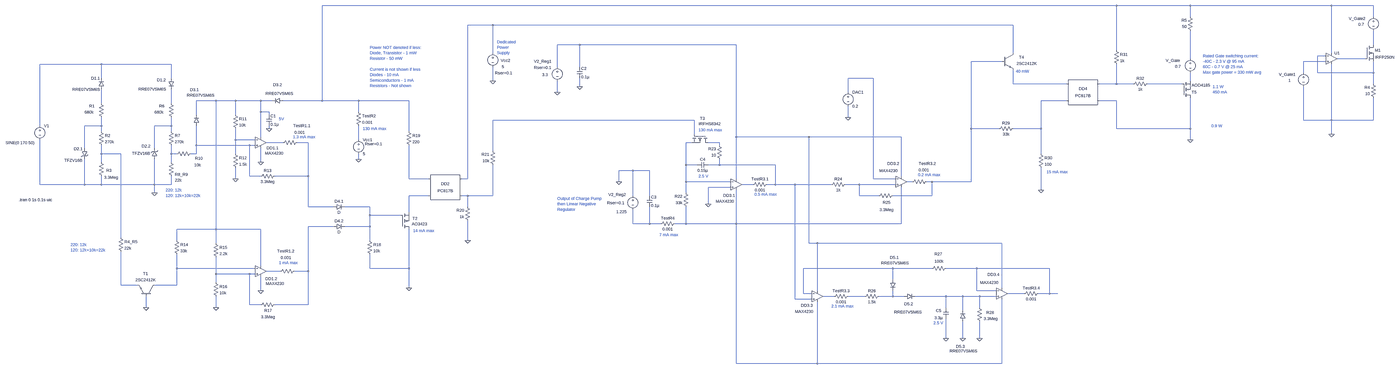
[diagram p0: schematic thyristor2.asc, whole sheet]
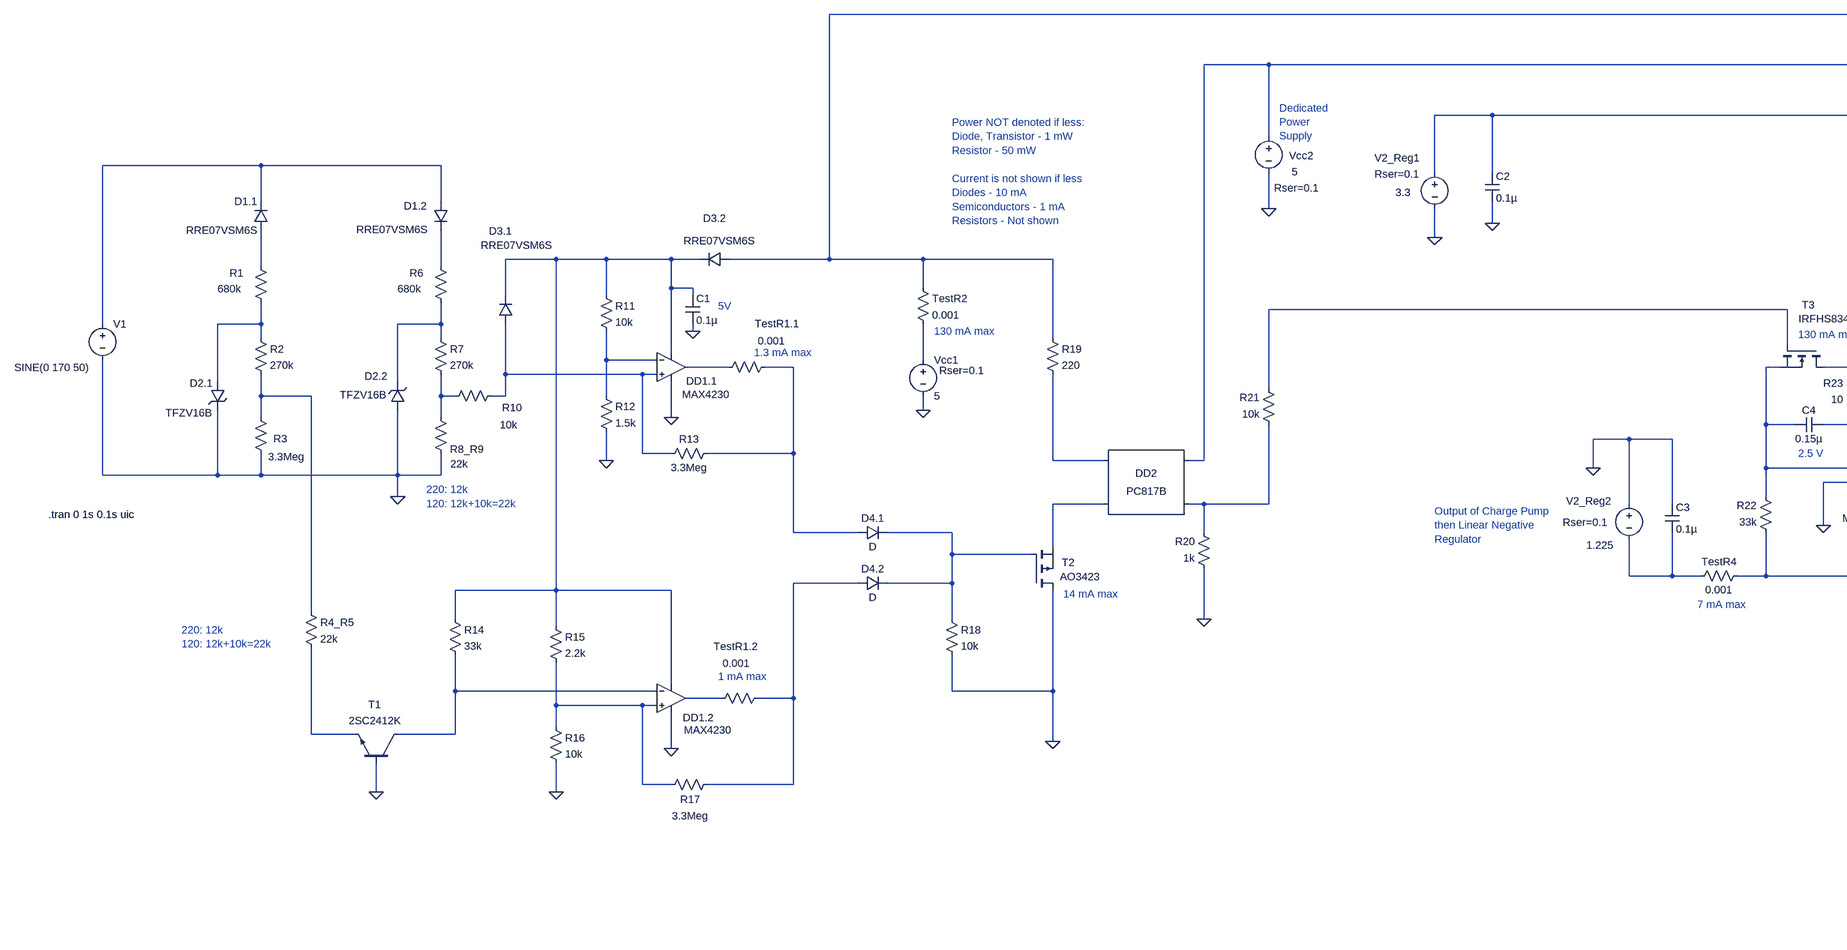
[diagram p1: schematic thyristor2.asc, part, row 1 of 1, column 1 of 2]
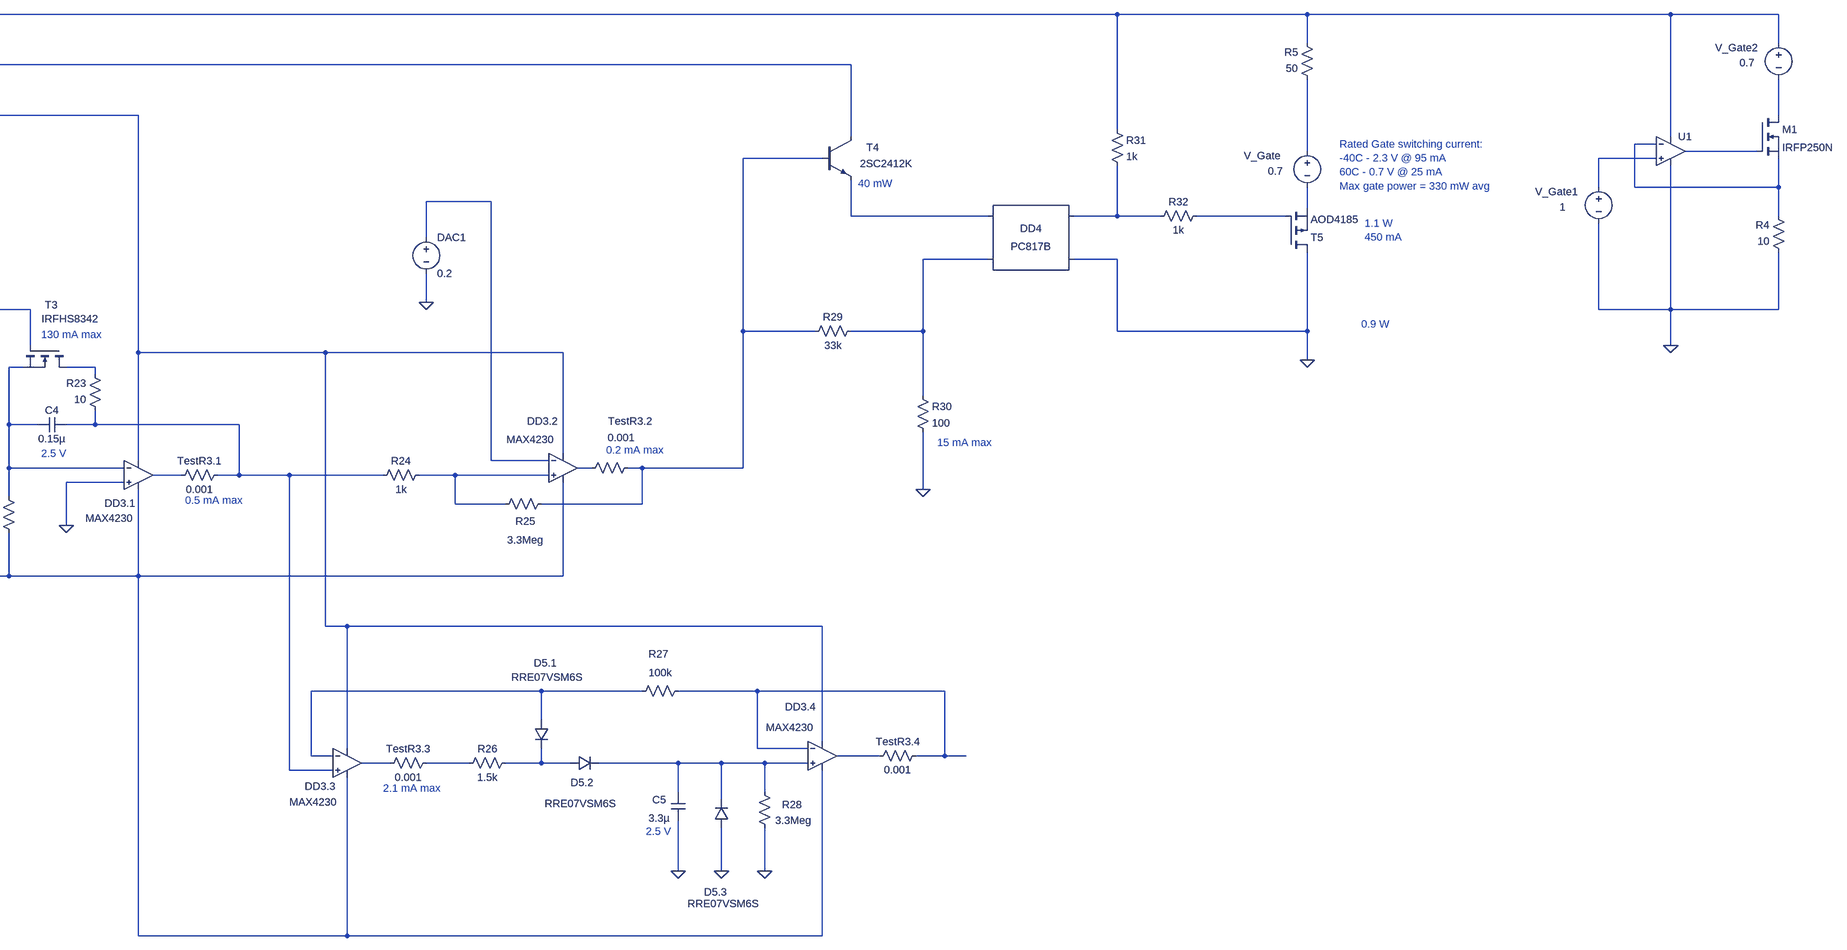
[diagram p2: schematic thyristor2.asc, part, row 1 of 1, column 2 of 2]
thyristor2.asc, the LTspice schematic file:
Version 4
SHEET 1 6072 1092
WIRE 4096 -1072 -464 -1072
WIRE 4608 -1072 4096 -1072
WIRE 5696 -1072 4608 -1072
WIRE 5936 -1072 5696 -1072
WIRE 4608 -1008 4608 -1072
WIRE 5936 -1008 5936 -1072
WIRE 512 -960 368 -960
WIRE 3504 -960 512 -960
WIRE 1024 -848 896 -848
WIRE 1920 -848 1024 -848
WIRE 5936 -848 5936 -928
WIRE 4096 -816 4096 -1072
WIRE 512 -800 512 -960
WIRE 3504 -800 3504 -960
WIRE 5696 -800 5696 -1072
WIRE 5664 -784 5616 -784
WIRE 4608 -768 4608 -928
WIRE 5888 -768 5728 -768
WIRE 3440 -752 3264 -752
WIRE 5664 -752 5536 -752
WIRE -1728 -736 -2080 -736
WIRE -1328 -736 -1728 -736
WIRE 896 -720 896 -848
WIRE 1024 -720 1024 -848
WIRE 5536 -688 5536 -752
WIRE 5616 -688 5616 -784
WIRE 5936 -688 5936 -752
WIRE 5936 -688 5616 -688
WIRE -1728 -656 -1728 -736
WIRE -1328 -656 -1328 -736
WIRE 2704 -656 2560 -656
WIRE 512 -640 512 -720
WIRE 4608 -640 4608 -688
WIRE 3504 -624 3504 -704
WIRE 3808 -624 3504 -624
WIRE 4096 -624 4096 -736
WIRE 4096 -624 4000 -624
WIRE 4192 -624 4096 -624
WIRE 4560 -624 4272 -624
WIRE 5936 -624 5936 -688
WIRE 1024 -608 1024 -656
WIRE 896 -576 896 -640
WIRE 2560 -576 2560 -656
WIRE -1072 -528 -1184 -528
WIRE -960 -528 -1072 -528
WIRE -816 -528 -960 -528
WIRE -752 -528 -816 -528
WIRE -464 -528 -464 -1072
WIRE -464 -528 -688 -528
WIRE -256 -528 -464 -528
WIRE 32 -528 -256 -528
WIRE 3808 -528 3664 -528
WIRE 4096 -528 4000 -528
WIRE -1728 -512 -1728 -592
WIRE -1328 -512 -1328 -592
WIRE -816 -464 -816 -528
WIRE -768 -464 -816 -464
WIRE -256 -464 -256 -528
WIRE -1184 -448 -1184 -528
WIRE -960 -448 -960 -528
WIRE -768 -448 -768 -464
WIRE 2560 -432 2560 -496
WIRE 1680 -416 512 -416
WIRE 5536 -416 5536 -608
WIRE 5696 -416 5696 -736
WIRE 5696 -416 5536 -416
WIRE 5936 -416 5936 -544
WIRE 5936 -416 5696 -416
WIRE -2080 -384 -2080 -736
WIRE -1728 -384 -1728 -432
WIRE -1728 -384 -1824 -384
WIRE -1328 -384 -1328 -432
WIRE -1328 -384 -1424 -384
WIRE -768 -368 -768 -384
WIRE 3264 -368 3264 -752
WIRE 3424 -368 3264 -368
WIRE 3664 -368 3664 -528
WIRE 3664 -368 3504 -368
WIRE 4096 -368 4096 -528
WIRE 4608 -368 4608 -544
WIRE 4608 -368 4096 -368
WIRE -1728 -352 -1728 -384
WIRE -1328 -352 -1328 -384
WIRE 32 -352 32 -528
WIRE 1680 -336 1680 -416
WIRE 5696 -336 5696 -416
WIRE -816 -320 -816 -464
WIRE 1920 -320 1920 -848
WIRE 2336 -320 1920 -320
WIRE 2864 -320 2336 -320
WIRE -960 -304 -960 -368
WIRE -848 -304 -960 -304
WIRE -256 -304 -256 -384
WIRE 4608 -304 4608 -368
WIRE -688 -288 -784 -288
WIRE -544 -288 -608 -288
WIRE 1664 -288 1632 -288
WIRE 1824 -288 1760 -288
WIRE -1184 -272 -1184 -384
WIRE -880 -272 -1184 -272
WIRE -848 -272 -880 -272
WIRE 1824 -272 1824 -288
WIRE -1824 -256 -1824 -384
WIRE -1424 -256 -1424 -384
WIRE 512 -240 512 -416
WIRE -1728 -224 -1728 -272
WIRE -1616 -224 -1728 -224
WIRE -1328 -224 -1328 -272
WIRE -1296 -224 -1328 -224
WIRE -1184 -224 -1184 -272
WIRE -1184 -224 -1216 -224
WIRE -960 -224 -960 -304
WIRE 3664 -224 3664 -368
WIRE -256 -192 -256 -224
WIRE -1728 -176 -1728 -224
WIRE -1328 -176 -1328 -224
WIRE -816 -176 -816 -256
WIRE 1632 -160 1632 -288
WIRE 1696 -160 1632 -160
WIRE 1824 -160 1824 -192
WIRE 1824 -160 1760 -160
WIRE 2144 -160 1824 -160
WIRE 1328 -128 1248 -128
WIRE 1424 -128 1328 -128
WIRE -880 -96 -880 -272
WIRE -816 -96 -880 -96
WIRE -544 -96 -544 -288
WIRE -544 -96 -736 -96
WIRE 2864 -96 2864 -320
WIRE -960 -80 -960 -144
WIRE 32 -80 32 -272
WIRE 144 -80 32 -80
WIRE 368 -80 368 -960
WIRE 368 -80 336 -80
WIRE 1920 -80 1920 -320
WIRE 2704 -80 2704 -656
WIRE 2832 -80 2704 -80
WIRE 1248 -64 1248 -128
WIRE 1632 -64 1632 -160
WIRE 1888 -64 1632 -64
WIRE 2928 -64 2896 -64
WIRE 3040 -64 3008 -64
WIRE 3264 -64 3264 -368
WIRE 3264 -64 3040 -64
WIRE -2080 -48 -2080 -304
WIRE -1824 -48 -1824 -192
WIRE -1824 -48 -2080 -48
WIRE -1728 -48 -1728 -96
WIRE -1728 -48 -1824 -48
WIRE -1424 -48 -1424 -192
WIRE -1424 -48 -1728 -48
WIRE -1328 -48 -1328 -96
WIRE -1328 -48 -1424 -48
WIRE 2016 -48 1952 -48
WIRE 2144 -48 2144 -160
WIRE 2144 -48 2096 -48
WIRE 2256 -48 2144 -48
WIRE 2464 -48 2256 -48
WIRE 2624 -48 2544 -48
WIRE 2832 -48 2624 -48
WIRE 1888 -32 1760 -32
WIRE 3664 -16 3664 -144
WIRE -1424 0 -1424 -48
WIRE 1632 0 1632 -64
WIRE 144 16 32 16
WIRE 368 16 336 16
WIRE 512 16 512 -160
WIRE 512 16 368 16
WIRE 1328 16 1328 -128
WIRE 1424 16 1424 -128
WIRE 2624 16 2624 -48
WIRE 2736 16 2624 16
WIRE 3040 16 3040 -64
WIRE 3040 16 2816 16
WIRE 1760 64 1760 -32
WIRE -544 80 -544 -96
WIRE -400 80 -544 80
WIRE -192 80 -336 80
WIRE 368 80 368 16
WIRE 32 112 32 16
WIRE -192 128 -192 80
WIRE -16 128 -192 128
WIRE 1328 176 1328 96
WIRE 1424 176 1424 80
WIRE 1424 176 1328 176
WIRE 1488 176 1424 176
WIRE 1632 176 1632 80
WIRE 1632 176 1568 176
WIRE 1920 176 1920 -16
WIRE 1920 176 1632 176
WIRE 2864 176 2864 -32
WIRE 2864 176 1920 176
WIRE -400 192 -544 192
WIRE -192 192 -192 128
WIRE -192 192 -336 192
WIRE -1072 208 -1072 -528
WIRE -1072 208 -1296 208
WIRE -816 208 -1072 208
WIRE -1616 256 -1616 -224
WIRE -1296 272 -1296 208
WIRE -192 272 -192 192
WIRE 368 272 368 160
WIRE -1072 288 -1072 208
WIRE 2336 288 2336 -320
WIRE 2384 288 2336 288
WIRE 3440 288 2384 288
WIRE -816 416 -816 208
WIRE -1296 432 -1296 352
WIRE -848 432 -1296 432
WIRE -192 432 -192 352
WIRE 32 432 32 208
WIRE 32 432 -192 432
WIRE 2816 432 2304 432
WIRE 3040 432 2816 432
WIRE 3296 432 3120 432
WIRE 3712 432 3296 432
WIRE -704 448 -784 448
WIRE -544 448 -544 192
WIRE -544 448 -624 448
WIRE -1072 464 -1072 368
WIRE -880 464 -1072 464
WIRE -848 464 -880 464
WIRE 2816 496 2816 432
WIRE -1072 512 -1072 464
WIRE -1616 528 -1616 336
WIRE -1520 528 -1616 528
WIRE -1296 528 -1296 432
WIRE -1296 528 -1424 528
WIRE 32 544 32 432
WIRE 3440 544 3440 288
WIRE -816 560 -816 480
WIRE 2384 560 2384 288
WIRE 3296 560 3296 432
WIRE 3408 560 3296 560
WIRE 2304 576 2304 432
WIRE 2352 576 2304 576
WIRE 3568 576 3472 576
WIRE 3712 576 3712 432
WIRE 3712 576 3648 576
WIRE 3760 576 3712 576
WIRE 2480 592 2416 592
WIRE 2656 592 2560 592
WIRE 2816 592 2816 560
WIRE 2816 592 2736 592
WIRE 2880 592 2816 592
WIRE 3120 592 2944 592
WIRE 3216 592 3120 592
WIRE 3312 592 3216 592
WIRE 3408 592 3312 592
WIRE 2256 608 2256 -48
WIRE 2352 608 2256 608
WIRE -880 640 -880 464
WIRE -816 640 -880 640
WIRE -544 640 -544 448
WIRE -544 640 -736 640
WIRE -1472 656 -1472 592
WIRE -1072 656 -1072 592
WIRE 3120 656 3120 592
WIRE 3312 656 3312 592
WIRE 3216 672 3216 592
WIRE 3120 832 3120 720
WIRE 3216 832 3216 736
WIRE 3312 832 3312 736
WIRE 1920 976 1920 176
WIRE 2384 976 2384 624
WIRE 2384 976 1920 976
WIRE 3440 976 3440 608
WIRE 3440 976 2384 976
FLAG -1424 0 0
FLAG -960 -80 0
FLAG -816 -176 0
FLAG 1760 64 0
FLAG 2560 -432 0
FLAG 3120 832 0
FLAG 3312 832 0
FLAG 32 544 0
FLAG 368 272 0
FLAG -256 -192 0
FLAG -768 -368 0
FLAG 1024 -608 0
FLAG -1072 656 0
FLAG -816 560 0
FLAG -1472 656 0
FLAG 4608 -304 0
FLAG 3664 -16 0
FLAG 512 -640 0
FLAG 896 -576 0
FLAG 1248 -64 0
FLAG 3216 832 0
FLAG 5696 -336 0
SYMBOL voltage -2080 -400 R0
WINDOW 3 -196 113 Left 2
WINDOW 123 0 0 Left 0
WINDOW 39 0 0 Left 0
SYMATTR Value SINE(0 170 50)
SYMATTR InstName V1
SYMBOL res -1344 -528 R0
WINDOW 0 -54 31 Left 2
WINDOW 3 -80 66 Left 2
SYMATTR InstName R6
SYMATTR Value 680k
SYMBOL res -1344 -192 R0
WINDOW 0 36 87 Left 2
WINDOW 3 37 119 Left 2
SYMATTR InstName R8_R9
SYMATTR Value 22k
SYMBOL res -976 -464 R0
SYMATTR InstName R11
SYMATTR Value 10k
SYMBOL res -976 -240 R0
SYMATTR InstName R12
SYMATTR Value 1.5k
SYMBOL res 1648 96 R180
WINDOW 0 36 76 Left 2
WINDOW 3 36 40 Left 2
SYMATTR InstName R22
SYMATTR Value 33k
SYMBOL cap 1760 -176 R90
WINDOW 0 0 32 VBottom 2
WINDOW 3 32 32 VTop 2
SYMATTR InstName C4
SYMATTR Value 0.15µ
SYMBOL voltage 2560 -592 R0
WINDOW 123 0 0 Left 0
WINDOW 39 0 0 Left 0
SYMATTR InstName DAC1
SYMATTR Value 0.2
SYMBOL nmos 1760 -336 R90
WINDOW 3 -59 -71 VRight 2
WINDOW 0 -90 19 VRight 2
SYMATTR Value IRFHS8342
SYMATTR InstName T3
SYMBOL cap 3104 656 R0
WINDOW 0 -42 18 Left 2
WINDOW 3 -50 59 Left 2
SYMATTR InstName C5
SYMATTR Value 3.3µ
SYMBOL res 3024 448 R270
WINDOW 0 83 52 VTop 2
WINDOW 3 72 56 VBottom 2
SYMATTR InstName R27
SYMATTR Value 100k
SYMBOL OpAmps\\MAX4230 1920 -112 R0
WINDOW 0 -75 127 Left 2
WINDOW 3 -118 160 Left 2
SYMATTR InstName DD3.1
SYMBOL res 3328 752 R180
WINDOW 0 -67 67 Left 2
WINDOW 3 -89 32 Left 2
SYMATTR InstName R28
SYMATTR Value 3.3Meg
SYMBOL Optos\\PC817B 240 -32 R0
SYMATTR InstName DD2
SYMBOL res 16 -368 R0
SYMATTR InstName R19
SYMATTR Value 220
SYMBOL Optos\\PC817B 3904 -576 R0
SYMATTR InstName DD4
SYMBOL res 4080 -832 R0
SYMATTR InstName R31
SYMATTR Value 1k
SYMBOL pmos 4560 -544 M180
SYMATTR InstName T5
SYMATTR Value AOD4185
SYMBOL res 528 -144 R180
WINDOW 0 36 76 Left 2
WINDOW 3 36 40 Left 2
SYMATTR InstName R21
SYMATTR Value 10k
SYMBOL res 384 176 R180
WINDOW 0 36 76 Left 2
WINDOW 3 36 40 Left 2
SYMATTR InstName R20
SYMATTR Value 1k
SYMBOL res 1840 -176 R180
WINDOW 0 36 76 Left 2
WINDOW 3 36 40 Left 2
SYMATTR InstName R23
SYMATTR Value 10
SYMBOL res 3648 -240 R0
SYMATTR InstName R30
SYMATTR Value 100
SYMBOL npn 3440 -800 R0
WINDOW 0 98 24 Left 2
WINDOW 3 84 60 Left 2
SYMATTR InstName T4
SYMATTR Value 2SC2412K
SYMBOL res 4176 -608 R270
WINDOW 0 32 56 VTop 2
WINDOW 3 0 56 VBottom 2
SYMATTR InstName R32
SYMATTR Value 1k
SYMBOL OpAmps\\MAX4230 2384 528 R0
WINDOW 0 -94 116 Left 2
WINDOW 3 -128 151 Left 2
SYMATTR InstName DD3.3
SYMBOL OpAmps\\MAX4230 3440 512 R0
WINDOW 0 -83 -45 Left 2
WINDOW 3 -125 1 Left 2
SYMATTR InstName DD3.4
SYMBOL voltage -256 -320 R0
WINDOW 123 0 0 Left 0
WINDOW 39 36 40 Left 2
SYMATTR SpiceLine Rser=0.1
SYMATTR InstName Vcc1
SYMATTR Value 5
SYMBOL res 3408 -352 R270
WINDOW 0 32 56 VTop 2
WINDOW 3 0 56 VBottom 2
SYMATTR InstName R29
SYMATTR Value 33k
SYMBOL zener -1408 -192 R180
WINDOW 0 39 76 Left 2
WINDOW 3 41 34 Left 2
SYMATTR InstName D2.2
SYMATTR Value TFZV16B
SYMBOL cap -784 -448 R0
SYMATTR InstName C1
SYMATTR Value 0.1µ
SYMBOL res -1312 -208 R270
WINDOW 0 -26 142 VTop 2
WINDOW 3 -33 135 VBottom 2
SYMATTR InstName R10
SYMATTR Value 10k
SYMBOL res -1344 -368 R0
SYMATTR InstName R7
SYMATTR Value 270k
SYMBOL diode -1712 -592 R180
WINDOW 0 24 64 Left 2
WINDOW 3 24 0 Left 2
SYMATTR InstName D1.1
SYMATTR Value RRE07VSM6S
SYMBOL diode -1168 -384 R180
WINDOW 0 2 206 Left 2
WINDOW 3 -87 175 Left 2
SYMATTR InstName D3.1
SYMATTR Value RRE07VSM6S
SYMBOL diode -688 -544 R90
WINDOW 0 -59 32 VBottom 2
WINDOW 3 -40 21 VTop 2
SYMATTR InstName D3.2
SYMATTR Value RRE07VSM6S
SYMBOL diode 2880 608 R270
WINDOW 0 -43 26 VTop 2
WINDOW 3 -59 22 VBottom 2
SYMATTR InstName D5.2
SYMATTR Value RRE07VSM6S
SYMBOL diode 2800 496 R0
WINDOW 0 -1 -126 Left 2
WINDOW 3 -51 -95 Left 2
SYMATTR InstName D5.1
SYMATTR Value RRE07VSM6S
SYMBOL OpAmps\\MAX4230 2864 -128 R0
WINDOW 0 -80 -40 Left 2
WINDOW 3 -126 1 Left 2
SYMATTR InstName DD3.2
SYMBOL cap 1008 -720 R0
SYMATTR InstName C2
SYMATTR Value 0.1µ
SYMBOL cap 1408 16 R0
SYMATTR InstName C3
SYMATTR Value 0.1µ
SYMBOL OpAmps\\MAX4230 -816 -352 R0
WINDOW 0 33 95 Left 2
WINDOW 3 24 125 Left 2
SYMATTR InstName DD1.1
SYMBOL res -832 -80 R270
WINDOW 0 32 56 VTop 2
WINDOW 3 0 56 VBottom 2
SYMATTR InstName R13
SYMATTR Value 3.3Meg
SYMBOL res 2720 32 R270
WINDOW 0 -38 60 VTop 2
WINDOW 3 -49 60 VBottom 2
SYMATTR InstName R25
SYMATTR Value 3.3Meg
SYMBOL res 2448 -32 R270
WINDOW 0 32 56 VTop 2
WINDOW 3 0 56 VBottom 2
SYMATTR InstName R24
SYMATTR Value 1k
SYMBOL res -1744 -528 R0
WINDOW 0 -54 31 Left 2
WINDOW 3 -80 66 Left 2
SYMATTR InstName R1
SYMATTR Value 680k
SYMBOL res -1744 -192 R0
WINDOW 0 44 63 Left 2
WINDOW 3 32 103 Left 2
SYMATTR InstName R3
SYMATTR Value 3.3Meg
SYMBOL zener -1840 -256 R0
WINDOW 0 -46 4 Left 2
WINDOW 3 -100 70 Left 2
SYMATTR InstName D2.1
SYMATTR Value TFZV16B
SYMBOL res -1744 -368 R0
SYMATTR InstName R2
SYMATTR Value 270k
SYMBOL diode -1344 -656 R0
WINDOW 0 -66 10 Left 2
WINDOW 3 -172 62 Left 2
SYMATTR InstName D1.2
SYMATTR Value RRE07VSM6S
SYMBOL res -1088 272 R0
SYMATTR InstName R15
SYMATTR Value 2.2k
SYMBOL res -1088 496 R0
SYMATTR InstName R16
SYMATTR Value 10k
SYMBOL OpAmps\\MAX4230 -816 384 R0
WINDOW 0 26 107 Left 2
WINDOW 3 28 135 Left 2
SYMATTR InstName DD1.2
SYMBOL res -832 656 R270
WINDOW 0 -33 58 VTop 2
WINDOW 3 -38 58 VBottom 2
SYMATTR InstName R17
SYMATTR Value 3.3Meg
SYMBOL npn -1424 592 M270
WINDOW 0 130 65 VLeft 2
WINDOW 3 94 109 VLeft 2
SYMATTR InstName T1
SYMATTR Value 2SC2412K
SYMBOL res -1312 256 R0
SYMATTR InstName R14
SYMATTR Value 33k
SYMBOL res -1632 240 R0
SYMATTR InstName R4_R5
SYMATTR Value 22k
SYMBOL diode -400 96 R270
WINDOW 0 32 32 VTop 2
WINDOW 3 0 32 VBottom 2
SYMATTR InstName D4.1
SYMBOL diode -400 208 R270
WINDOW 0 32 32 VTop 2
WINDOW 3 0 32 VBottom 2
SYMATTR InstName D4.2
SYMBOL res -208 256 R0
SYMATTR InstName R18
SYMATTR Value 10k
SYMBOL pmos -16 208 M180
WINDOW 0 68 62 Left 2
WINDOW 3 64 30 Left 2
SYMATTR InstName T2
SYMATTR Value AO3423
SYMBOL voltage 512 -816 R0
WINDOW 123 0 0 Left 0
WINDOW 39 12 130 Left 2
WINDOW 0 45 58 Left 2
WINDOW 3 51 94 Left 2
SYMATTR SpiceLine Rser=0.1
SYMATTR InstName Vcc2
SYMATTR Value 5
SYMBOL voltage 896 -736 R0
WINDOW 123 0 0 Left 0
WINDOW 39 -134 19 Left 2
WINDOW 0 -134 -17 Left 2
WINDOW 3 -87 60 Left 2
SYMATTR SpiceLine Rser=0.1
SYMATTR InstName V2_Reg1
SYMATTR Value 3.3
SYMBOL voltage 1328 0 R0
WINDOW 123 0 0 Left 0
WINDOW 39 -147 57 Left 2
WINDOW 0 -140 10 Left 2
WINDOW 3 -95 108 Left 2
SYMATTR SpiceLine Rser=0.1
SYMATTR InstName V2_Reg2
SYMATTR Value 1.225
SYMBOL res 2000 -32 R270
WINDOW 0 32 56 VTop 2
WINDOW 3 0 56 VBottom 2
SYMATTR InstName TestR3.1
SYMATTR Value 0.001
SYMBOL res 2912 -48 R270
WINDOW 0 104 101 VTop 2
WINDOW 3 99 82 VBottom 2
SYMATTR InstName TestR3.2
SYMATTR Value 0.001
SYMBOL res 2464 608 R270
WINDOW 0 32 56 VTop 2
WINDOW 3 0 56 VBottom 2
SYMATTR InstName TestR3.3
SYMATTR Value 0.001
SYMBOL res 3552 592 R270
WINDOW 0 32 56 VTop 2
WINDOW 3 0 56 VBottom 2
SYMATTR InstName TestR3.4
SYMATTR Value 0.001
SYMBOL res 1472 192 R270
WINDOW 0 32 56 VTop 2
WINDOW 3 0 56 VBottom 2
SYMATTR InstName TestR4
SYMATTR Value 0.001
SYMBOL res 2640 608 R270
WINDOW 0 32 56 VTop 2
WINDOW 3 0 56 VBottom 2
SYMATTR InstName R26
SYMATTR Value 1.5k
SYMBOL diode 3232 736 R180
WINDOW 0 4 -143 Left 2
WINDOW 3 -67 -169 Left 2
SYMATTR InstName D5.3
SYMATTR Value RRE07VSM6S
SYMBOL res -720 464 R270
WINDOW 0 115 47 VTop 2
WINDOW 3 109 49 VBottom 2
SYMATTR InstName TestR1.2
SYMATTR Value 0.001
SYMBOL res -704 -272 R270
WINDOW 0 97 123 VTop 2
WINDOW 3 90 111 VBottom 2
SYMATTR InstName TestR1.1
SYMATTR Value 0.001
SYMBOL res -272 -480 R0
SYMATTR InstName TestR2
SYMATTR Value 0.001
SYMBOL voltage 4608 -784 R0
WINDOW 123 0 0 Left 0
WINDOW 39 -134 19 Left 2
WINDOW 0 -141 26 Left 2
WINDOW 3 -87 60 Left 2
SYMATTR InstName V_Gate
SYMATTR Value 0.7
SYMBOL res 4624 -912 R180
WINDOW 0 36 76 Left 2
WINDOW 3 36 40 Left 2
SYMATTR InstName R5
SYMATTR Value 50
SYMBOL OpAmps\\UniversalOpAmp 5696 -768 R0
SYMATTR InstName U1
SYMBOL nmos 5888 -848 R0
SYMATTR InstName M1
SYMATTR Value IRFP250N
SYMBOL res 5952 -528 R180
WINDOW 0 36 76 Left 2
WINDOW 3 36 40 Left 2
SYMATTR InstName R4
SYMATTR Value 10
SYMBOL voltage 5536 -704 R0
WINDOW 123 0 0 Left 0
WINDOW 39 -134 19 Left 2
WINDOW 0 -141 26 Left 2
WINDOW 3 -87 60 Left 2
SYMATTR InstName V_Gate1
SYMATTR Value 1
SYMBOL voltage 5936 -1024 R0
WINDOW 123 0 0 Left 0
WINDOW 39 -134 19 Left 2
WINDOW 0 -141 26 Left 2
WINDOW 3 -87 60 Left 2
SYMATTR InstName V_Gate2
SYMATTR Value 0.7
TEXT -2200 40 Left 2 !.tran 0 1s 0.1s uic
TEXT 4728 -384 Left 2 ;0.9 W
TEXT 4736 -608 Left 2 ;1.1 W\n450 mA
TEXT 3520 -696 Left 2 ;40 mW
TEXT -192 -832 Left 2 ;Power NOT denoted if less:\nDiode, Transistor - 1 mW\nResistor - 50 mW\n \nCurrent is not shown if less\nDiodes - 10 mA\nSemiconductors - 1 mA\nResistors - Not shown
TEXT 3696 -120 Left 2 ;15 mA max
TEXT -1360 -16 Left 2 ;220: 12k\n120: 12k+10k=22k
TEXT -1904 296 Left 2 ;220: 12k\n120: 12k+10k=22k
TEXT 536 -864 Left 2 ;Dedicated\nPower\nSupply
TEXT 896 32 Left 2 ;Output of Charge Pump\nthen Linear Negative\nRegulator
TEXT -632 -320 Left 2 ;1.3 mA max
TEXT -712 -424 Left 2 ;5V
TEXT -712 400 Left 2 ;1 mA max
TEXT 56 216 Left 2 ;14 mA max
TEXT 1704 -360 Left 2 ;130 mA max
TEXT 1704 -96 Left 2 ;2.5 V
TEXT 2024 8 Left 2 ;0.5 mA max
TEXT 2960 -104 Left 2 ;0.2 mA max
TEXT 2464 648 Left 2 ;2.1 mA max
TEXT 3048 744 Left 2 ;2.5 V
TEXT -232 -368 Left 2 ;130 mA max
TEXT 1480 240 Left 2 ;7 mA max
TEXT 4680 -784 Left 2 ;Rated Gate switching current:\n-40C - 2.3 V @ 95 mA\n60C - 0.7 V @ 25 mA\nMax gate power = 330 mW avg

The netlist it stands for:
* thyristor2.asc
V1 N010 0 SINE(0 170 50)
R6 N019 N022 680k
R8_R9 N031 0 22k
R11 N016 N023 10k
R12 N023 0 1.5k
R22 N041 N027 33k
C4 N032 N027 0.15µ
V§DAC1 N011 0 0.2
M§T3 N028 N020 N027 N027 IRFHS8342
C5 N053 0 3.3µ
R27 N044 N045 100k
XDD3.1 0 N027 N003 N041 N035 MAX4230  ; pins In+ In- V+ V- OUT
R28 0 N053 3.3Meg
XDD2 N033 N037 N002 N038 PC817 Igain=1.5m
R19 N001 N033 220
XDD4 N013 N017 N014 0 PC817 Igain=1.5m
R31 N001 N014 1k
M§T5 0 N015 N012 N012 AOD4185
R21 N038 N020 10k
R20 0 N038 1k
R23 N032 N028 10
R30 N017 0 100
Q§T4 N002 N008 N013 0 2SC2412K
R32 N014 N015 1k
XDD3.3 N032 N044 N003 N041 N050 MAX4230  ; pins In+ In- V+ V- OUT
XDD3.4 N053 N045 N003 N041 N049 MAX4230  ; pins In+ In- V+ V- OUT
Vcc1 N024 0 5 Rser=0.1
R29 N008 N017 33k
D2.2 0 N022 TFZV16B
C1 N016 0 0.1µ
R10 N031 N029 10k
R7 N022 N031 270k
D1.1 N018 N010 RRE07VSM6S
D3.1 N029 N016 RRE07VSM6S
D3.2 N001 N016 RRE07VSM6S
D5.2 N052 N053 RRE07VSM6S
D5.1 N044 N052 RRE07VSM6S
XDD3.2 N036 N011 N003 N041 N034 MAX4230  ; pins In+ In- V+ V- OUT
C2 N003 0 0.1µ
C3 0 N040 0.1µ
XDD1.1 N029 N023 N016 0 N025 MAX4230  ; pins In+ In- V+ V- OUT
R13 N029 N026 3.3Meg
R25 N036 N008 3.3Meg
R24 N032 N036 1k
R1 N018 N021 680k
R3 N030 0 3.3Meg
D2.1 N021 0 TFZV16B
R2 N021 N030 270k
D1.2 N010 N019 RRE07VSM6S
R15 N016 N047 2.2k
R16 N047 0 10k
XDD1.2 N047 N043 N016 0 N046 MAX4230  ; pins In+ In- V+ V- OUT
R17 N047 N042 3.3Meg
Q§T1 N043 0 N048 0 2SC2412K
R14 N016 N043 33k
R4_R5 N030 N048 22k
D4.1 N026 N039 D
D4.2 N042 N039 D
R18 N039 0 10k
M§T2 0 N039 N037 N037 AO3423
Vcc2 N002 0 5 Rser=0.1
V2_Reg1 N003 0 3.3 Rser=0.1
V2_Reg2 0 N040 1.225 Rser=0.1
R§TestR3.1 N035 N032 0.001
R§TestR3.2 N034 N008 0.001
R§TestR3.3 N050 N051 0.001
R§TestR3.4 N049 N045 0.001
R§TestR4 N040 N041 0.001
R26 N051 N052 1.5k
D5.3 0 N053 RRE07VSM6S
R§TestR1.2 N046 N042 0.001
R§TestR1.1 N025 N026 0.001
R§TestR2 N001 N024 0.001
V_Gate N006 N012 0.7
R5 N006 N001 50
XU1 N009 N005 N001 0 N007 level1 Avol=1Meg GBW=10Meg Vos=0 En=0 Enk=0 In=0 Ink=0 Rin=500Meg  ; pins In+ In- V+ V- OUT
M1 N004 N007 N005 N005 IRFP250N
R4 0 N005 10
V_Gate1 N009 0 1
V_Gate2 N001 N004 0.7
.model D D
.lib standard.dio
.model NPN NPN
.model PNP PNP
.lib standard.bjt
.model NMOS NMOS
.model PMOS PMOS
.lib standard.mos
.tran 0 1s 0.1s uic
* 0.9 W
* 1.1 W
* 450 mA
* 40 mW
* Power NOT denoted if less:
* Diode, Transistor - 1 mW
* Resistor - 50 mW
* Current is not shown if less
* Diodes - 10 mA
* Semiconductors - 1 mA
* Resistors - Not shown
* 15 mA max
* 220: 12k
* 120: 12k+10k=22k
* 220: 12k
* 120: 12k+10k=22k
* Dedicated
* Power
* Supply
* Output of Charge Pump
* then Linear Negative
* Regulator
* 1.3 mA max
* 5V
* 1 mA max
* 14 mA max
* 130 mA max
* 2.5 V
* 0.5 mA max
* 0.2 mA max
* 2.1 mA max
* 2.5 V
* 130 mA max
* 7 mA max
* Rated Gate switching current:
* -40C - 2.3 V @ 95 mA
* 60C - 0.7 V @ 25 mA
* Max gate power = 330 mW avg
.lib MAX4230.lib
.lib PC817.sub
.lib UniversalOpAmp1.lib
.backanno
.end